# Altium schematic sheet TOP.SchDoc
size A4; SheetNumber: 1; SheetTotal: 4
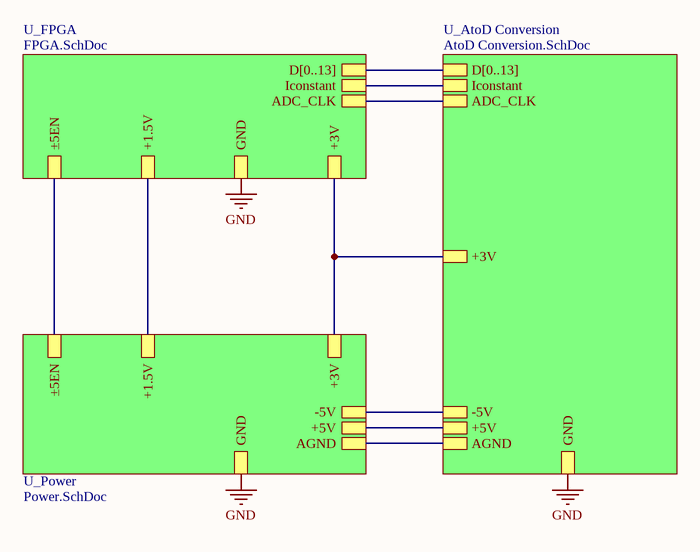
[diagram p0: TOP.SchDoc]

## Sub-sheets
U_AtoD Conversion = AtoD Conversion.SchDoc: -5V, +5V, +3V, ADC_CLK, GND, AGND, D[0..13], Iconstant
U_FPGA = FPGA.SchDoc: GND, ±5EN, +1.5V, +3V, Iconstant, D[0..13], ADC_CLK
U_Power = Power.SchDoc: GND, ±5EN, +5V, -5V, +1.5V, +3V, AGND

## Nets
GND: sheet U_AtoD Conversion/GND, sheet U_FPGA/GND, sheet U_Power/GND
(unnamed): sheet U_AtoD Conversion/-5V, sheet U_Power/-5V
(unnamed): sheet U_AtoD Conversion/+5V, sheet U_Power/+5V
(unnamed): sheet U_AtoD Conversion/+3V, sheet U_FPGA/+3V, sheet U_Power/+3V
(unnamed): sheet U_AtoD Conversion/ADC_CLK, sheet U_FPGA/ADC_CLK
(unnamed): sheet U_AtoD Conversion/AGND, sheet U_Power/AGND
(unnamed): sheet U_AtoD Conversion/Iconstant, sheet U_FPGA/Iconstant
(unnamed): sheet U_FPGA/±5EN, sheet U_Power/±5EN
(unnamed): sheet U_FPGA/+1.5V, sheet U_Power/+1.5V

## Buses and harness runs
bus sheet U_AtoD Conversion/D[0..13] = sheet U_FPGA/D[0..13]

## Notes on the sheet
- Page
- of